# EAGLE design adc_lemon (EAGLE 6.0)
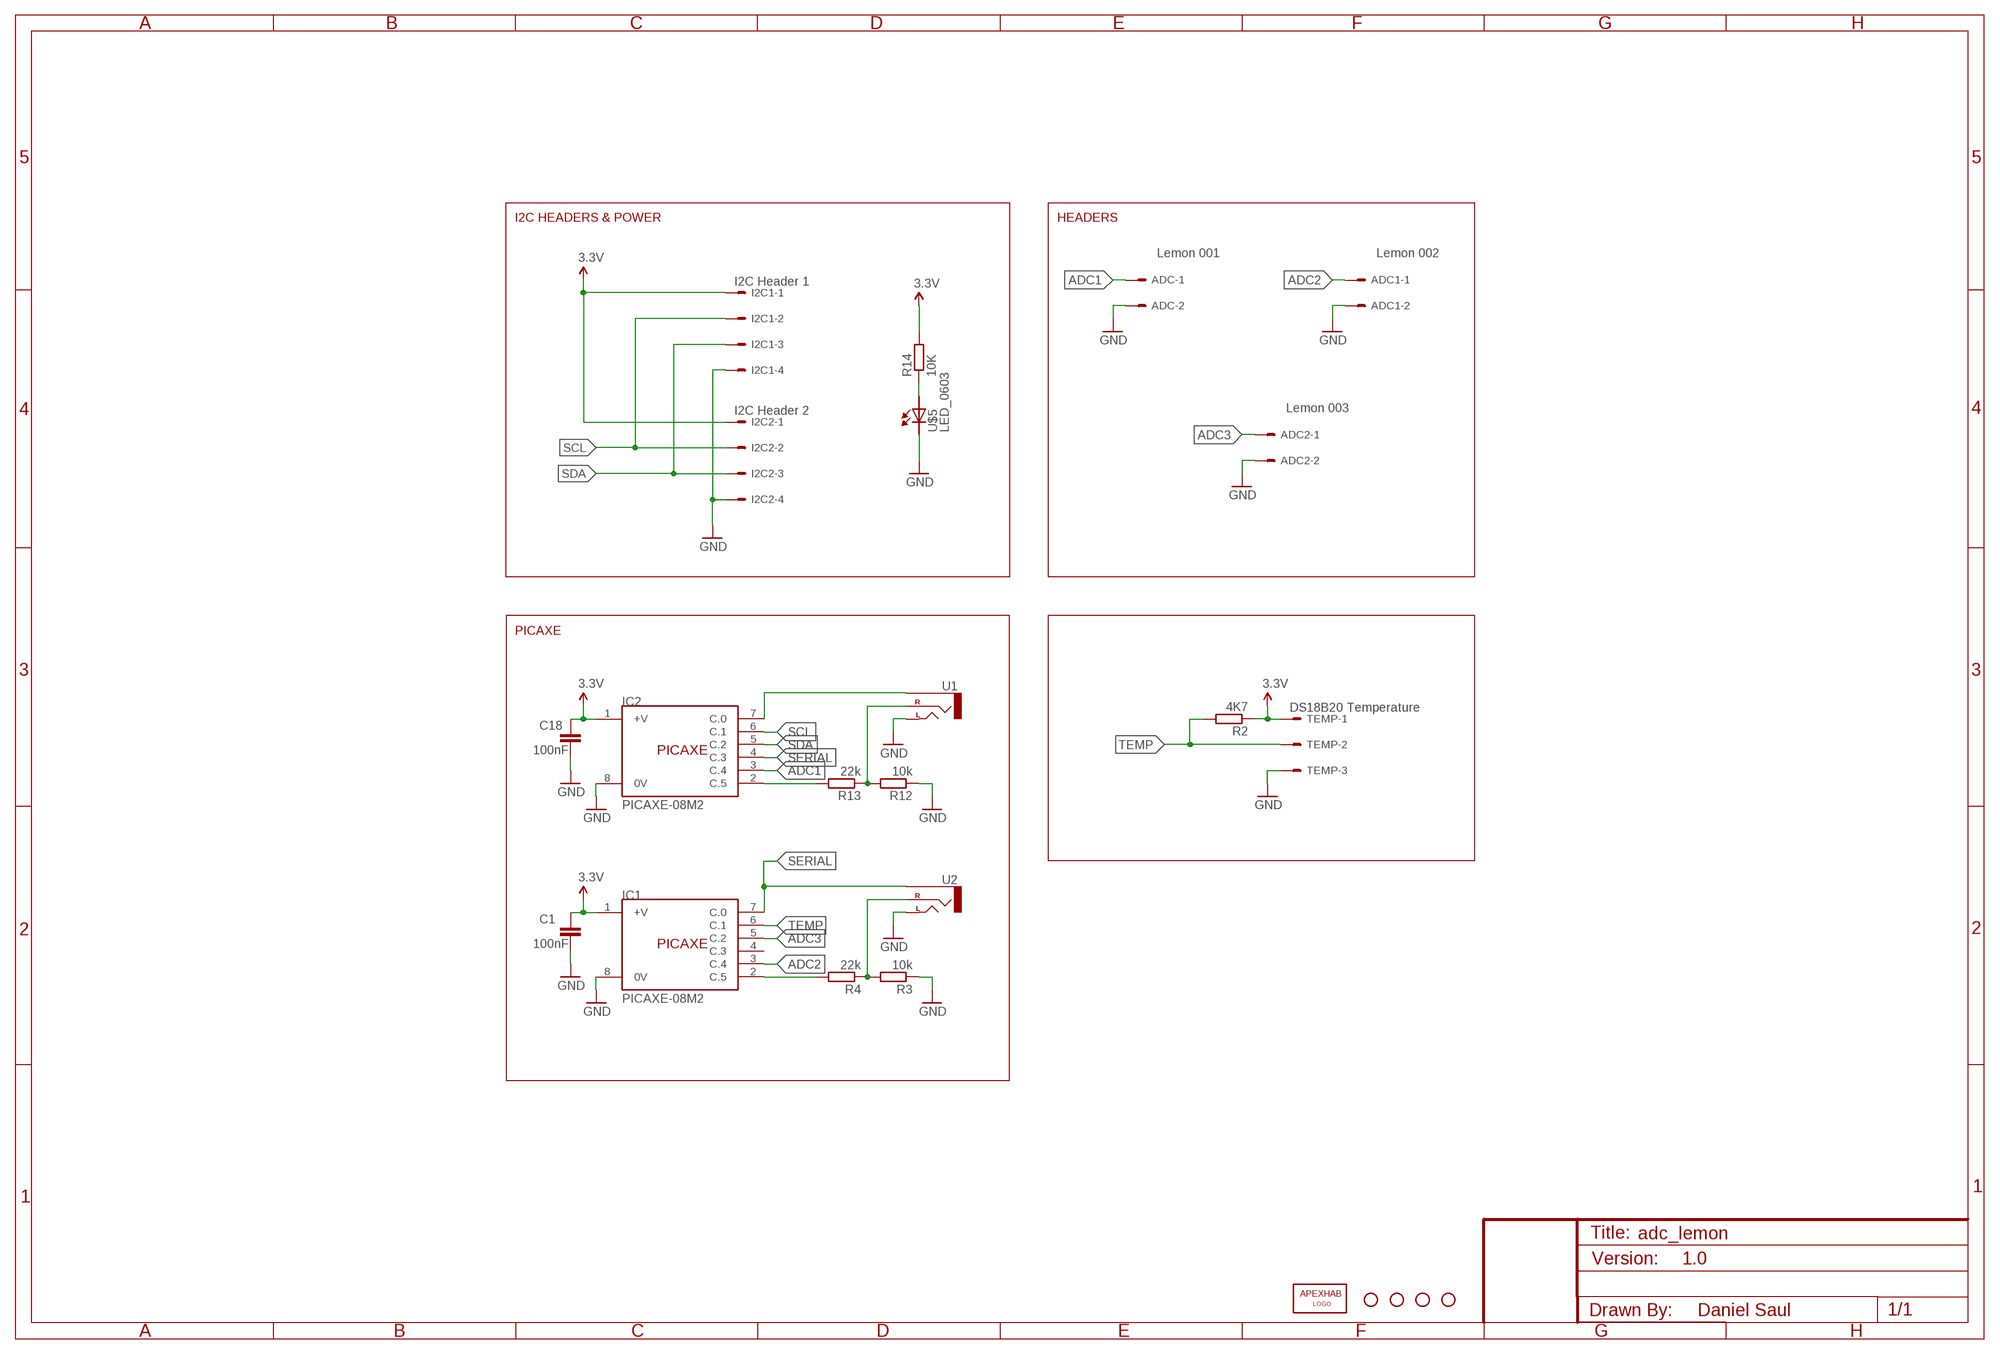
[diagram p0: schematic, sheet 1]

## Parts
ADC  Lemon 001  22-27-2021-02  [6410-02]
ADC1  Lemon 002  22-27-2021-02  [6410-02]
ADC2  Lemon 003  22-27-2021-02  [6410-02]
C1  100nF  C-EUC0805  [C0805]
C18  100nF  C-EUC0805  [C0805]
I2C1  I2C Header 1  22-27-2041-04  [6410-04]
I2C2  I2C Header 2  22-27-2041-04  [6410-04]
IC1  PICAXE-08M2  [SOIC8]
IC2  PICAXE-08M2  [SOIC8]
JP1  APEXHAB-LOGO_APEXHAB-SMALL  [APEXHAB-LOGO-SMALL]
JP2  STAND-OFF  [STAND-OFF]
JP3  STAND-OFF  [STAND-OFF]
JP4  STAND-OFF  [STAND-OFF]
JP5  STAND-OFF  [STAND-OFF]
R2  4K7  R-EU_R0805  [R0805]
R3  10k  R-EU_R0805  [R0805]
R4  22k  R-EU_R0805  [R0805]
R12  10k  R-EU_R0805  [R0805]
R13  22k  R-EU_R0805  [R0805]
R14  10K  R-EU_R0805  [R0805]
TEMP  DS18B20 Temperature  22-27-2031-03  [6410-03]
U1  AUDIO-JACKPTH  [AUDIO-JACK]
U2  AUDIO-JACKPTH  [AUDIO-JACK]
U$5  LED_0603  [CHIPLED_0603]

## Nets
3.3V: C1.1 C18.1 I2C1.1 I2C2.1 IC1.1(+V) IC2.1(+V) R2.1 R14.2 TEMP.1
ADC1: ADC.1 IC2.3(C.4)
ADC2: ADC1.1 IC1.3(C.4)
ADC3: ADC2.1 IC1.5(C.2)
GND: ADC1.2 ADC2.2 ADC.2 C1.2 C18.2 I2C1.4 I2C2.4 IC1.8(0V) IC2.8(0V) R3.1 R12.1 TEMP.3 U1.TIP(LEFT) U2.TIP(LEFT) U$5.C
N$4: IC1.2(C.5) R4.2
N$5: R3.2 R4.1 U2.RING(RIGHT)
N$17: IC2.2(C.5) R13.2
N$18: IC2.7(C.0) U1.SLEEVE
N$20: R12.2 R13.1 U1.RING(RIGHT)
N$21: R14.1 U$5.A
SCL: I2C1.2 I2C2.2 IC2.6(C.1)
SDA: I2C1.3 I2C2.3 IC2.5(C.2)
SERIAL: IC1.7(C.0) IC2.4(C.3) U2.SLEEVE
TEMP: IC1.6(C.1) R2.2 TEMP.2
Unconnected: IC1.4(C.3)

## Notes on the sheet
- I2C HEADERS & POWER | HEADERS
- PICAXE
- 1.0
- Daniel Saul

## Library data of the parts
ADC ADC1 ADC2 = apex:22-?-02: CONNECTOR wire to board 2.54 mm (.1 inch) pitch header; OC_FARNELL: unknown; OC_NEWARK: unknown
C1 C18 = rcl:C-EU: CAPACITOR, European symbol
I2C1 I2C2 = apex:22-?-04: CONNECTOR wire to board 2.54 mm (.1 inch) pitch header; OC_FARNELL: unknown; OC_NEWARK: unknown
IC1 IC2 = apex:PICAXE-08M2
JP1 = apex:APEXHAB-LOGO: ApexHAB PCB Logo This is the standard ApexHAB PCB logo.
JP2-JP5 = apex:STAND-OFF: Stand Off This is the mechanical footprint for a #4 phillips button head screw. Use the keepout ring to avoid running the screw head into surrounding components. SKU : PRT-00447
R2-R4 R12-R14 = rcl:R-EU_: RESISTOR, European symbol
TEMP = apex:22-?-03: CONNECTOR wire to board 2.54 mm (.1 inch) pitch header; OC_FARNELL: unknown; OC_NEWARK: unknown
U1 U2 = SparkFun:AUDIO-JACK: 3.5mm Audio Jack Simple 3.5mm common PCB mount audio jack. SKU: PRT-08032
U$5 = apex:LED: SMD LED

## Board
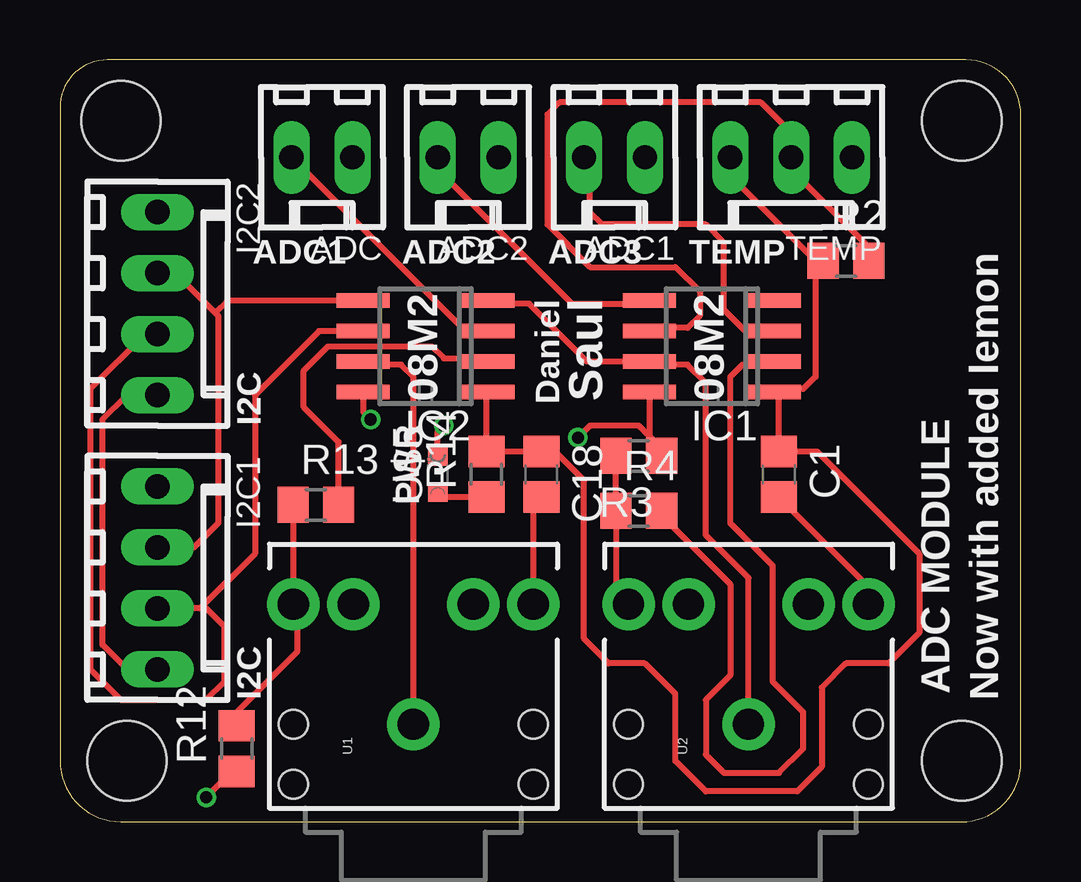
[diagram p1: board, top side]
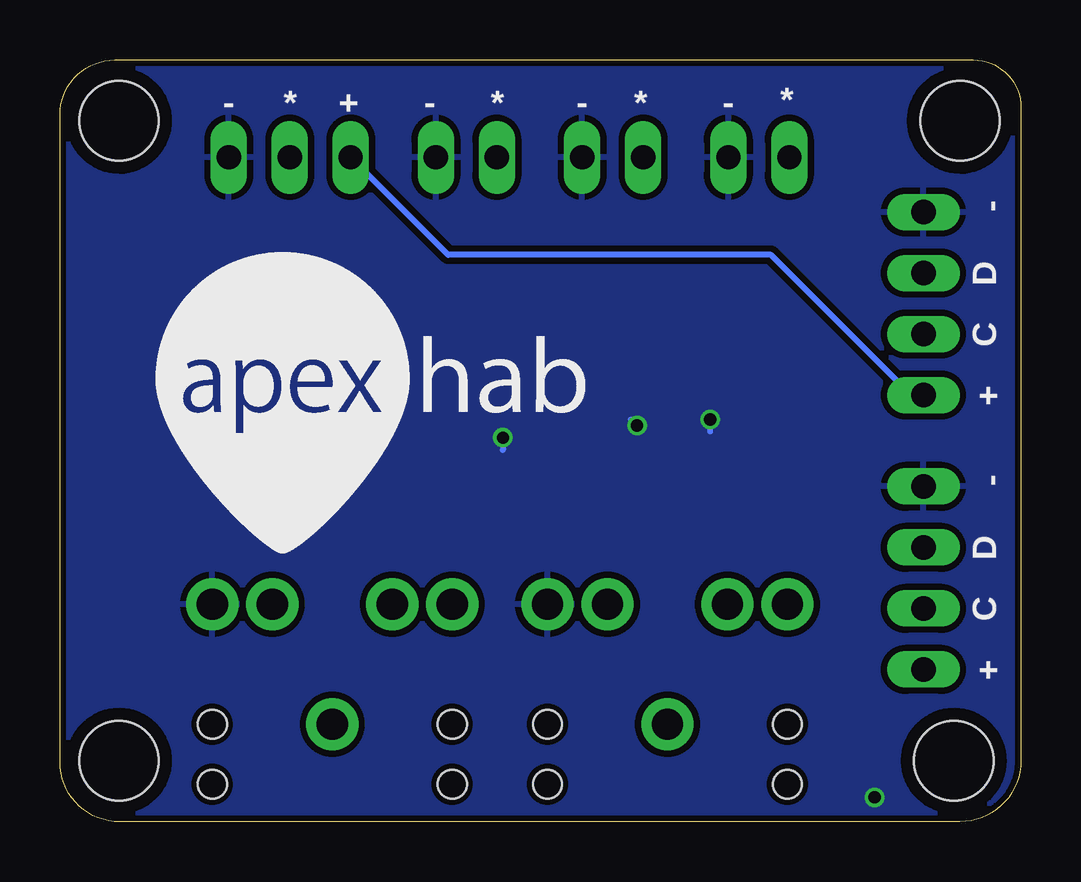
[diagram p2: board, bottom side, seen from below]

Size 40.06 x 31.74 mm. Coordinates in mm from the lower left corner, seen from the top.
Outline: 0,29.76 0,2.54 arc90 2.54,0 37.58,0 arc90 40.06,2.48 40.06,29.45 arc90 37.77,31.74 1.98,31.74 arc90 0,29.76
Copper layers (1*16): Top 0.035mm / dielectric 1.5mm / Bottom 0.035mm
Design rules: minimum track width 6mil, minimum drill 12mil, track to track 6mil, track to pad 6mil, pad to pad 6mil, via to via 6mil, smd to smd 0mil, copper to edge 10mil, drill to drill 10mil, minimum pad ring 10mil, minimum via ring 6mil, stop-mask expansion 2mil, vias tented up to drill 100mil, thermal gap 10mil

### Footprints (pad centres in the part's own frame; a part is rotated, then mirrored left to right if it is on the bottom)
6410-02 = drill 1.016 long: 1 1.27,0; 2 -1.27,0
C0805 = smd 1.3 x 1.5: 1 -0.95,0; 2 0.95,0
6410-04 = drill 1.016 long: 1 3.81,0; 2 1.27,0; 3 -1.27,0; 4 -3.81,0
SOIC8 = smd 0.6 x 2.2: 1 -1.905,-2.6; 2 -0.635,-2.6; 3 0.635,-2.6; 4 1.905,-2.6; 5 1.905,2.6; 6 0.635,2.6; 7 -0.635,2.6; 8 -1.905,2.6
STAND-OFF = hole 3.302: 0,0
R0805 = smd 1.3 x 1.5: 1 -0.95,0; 2 0.95,0
6410-03 = drill 1.016 long: 1 2.54,0; 2 0,0; 3 -2.54,0
AUDIO-JACK = drill 1.3 pad 2.184: RING 5,5; RSH 5,2.5; SLEEVE 0,0; TIP 5,-5; TSH 5,-2.5 | hole 1.2: 0,5; -2.5,5; -2.5,-5; 0,-5
CHIPLED_0603 = smd 0.8 x 0.8: A 0,-0.75; C 0,0.75

### Placement (x,y rotation side)
ADC  10.92,27.69 180 top
ADC1  23.11,27.69 180 top
ADC2  17.02,27.69 180 top
C1  29.97,14.48 270 top
C18  20.07,14.48 270 top
I2C1  4.06,10.16 270 top
I2C2  4.06,21.59 270 top
IC1  27.18,19.81 90 top
IC2  15.24,19.81 90 top
JP1  36.07,11.18 0 bottom
JP2  37.59,2.54 0 top
JP3  2.79,2.54 0 top
JP4  37.59,29.21 0 top
JP5  2.54,29.21 0 top
R2  32.77,23.37 0 top
R3  24.13,15.24 180 top
R4  24.13,12.95 0 top
R12  7.37,3.05 90 top
R13  10.67,13.21 0 top
R14  17.78,14.48 90 top
TEMP  30.48,27.69 180 top
U1  14.73,4.06 90 top
U2  28.7,4.06 90 top
U$5  15.75,14.48 0 top

### Tracks (layer width: path | path; a pad name or v marks a point on that pad's centre or on a via)
3.3V
  Top 0.254: I2C1.1 2.79,6.35 1.78,7.37 1.78,16.76 2.79,17.78 I2C2.1 | IC2.1 17.78,17.85 R14.2 C18.1 20.13,15.49 20.57,15.49 21.84,14.22 21.84,7.62 22.86,6.6 24.38,6.6 25.65,5.33 25.65,2.54 26.92,1.27 30.73,1.27 31.75,2.29 31.75,5.59 32.77,6.6 34.54,6.6 35.81,7.87 35.81,11.18 31.56,15.43 C1.1 29.97,17.71 IC1.1 29.91,18.03 30.99,18.03 31.5,18.54 31.5,23.37 | R2.1 31.5,23.37 | 31.5,23.37 27.94,26.92 TEMP.1
  Bottom 0.254: I2C2.1 4.57,17.78 10.41,23.62 23.88,23.62 TEMP.1
ADC1
  Top 0.254: ADC.1 16.76,20.57 17.71,20.57 IC2.3
ADC2
  Top 0.254: IC1.3 28.57,20.45 27.69,21.34 27.69,24.13 26.92,24.89 22.61,24.89 22.1,25.4 22.1,27.43 ADC1.1
ADC3
  Top 0.254: ADC2.1 15.75,27.18 21.34,21.59 24.45,21.59 IC1.5
GND  (via drill 0.51)
  Top 0.254: U2.TIP 33.7,9.8 C1.2 | U1.TIP 19.73,13.19 C18.2 | U$5.C 15.75,16.26 v16,16.51 | IC2.8 12.64,17.08 v12.95,16.76 | IC1.8 24.58,15.74 R3.1 25.08,15.56 24.13,16.51 22.1,16.51 v21.59,16 | R12.1 7.18,2.1 v6.1,1.02
  Bottom 0.254: v16,16.51 16.26,16.76 | v12.95,16.76 12.95,16.26 | v21.59,16 21.59,15.49 | v6.1,1.02 6.35,1.02
  pour Bottom (isolate 0.254): 0,0 40.13,0 40.13,31.75 0,31.75
N$4
  Top 0.254: R4.2 25.08,12.77 27.94,9.91 27.94,6.1 26.92,5.08 26.92,2.79 27.69,2.03 29.97,2.03 30.99,3.05 30.99,4.57 29.72,5.84 29.72,10.67 27.94,12.45 27.94,18.54 28.45,19.05 29.65,19.05 IC1.2
N$5
  Top 0.254: U2.RING 23.18,9.59 R4.1 R3.2
N$17
  Top 0.254: R13.2 11.62,15.81 10.16,17.27 10.16,18.8 11.18,19.81 15.49,19.81 16,19.3 17.71,19.3 IC2.2
N$18
  Top 0.254: U1.SLEEVE 14.73,18.54 14.22,19.05 12.77,19.05 IC2.7
N$20
  Top 0.254: R12.2 7.37,4.57 9.91,7.11 9.91,8.89 U1.RING 9.72,9.08 R13.1
N$21
  Top 0.254: R14.1 15.95,13.53 U$5.A
SCL
  Top 0.254: I2C2.2 3.56,20.32 1.27,18.03 1.27,6.35 2.54,5.08 6.1,5.08 6.86,5.84 6.86,8.13 6.1,8.89 5.84,8.89 | 5.84,8.89 I2C1.2 | IC2.6 10.79,20.45 8.13,17.78 8.13,11.18 5.84,8.89
SDA
  Top 0.254: I2C2.3 4.83,22.86 6.48,21.21 | 6.48,21.21 6.6,21.08 6.6,12.45 5.59,11.43 I2C1.3 | IC2.5 6.99,21.72 6.48,21.21
SERIAL
  Top 0.254: U2.SLEEVE 28.7,10.16 26.92,11.94 26.92,18.29 26.16,19.05 24.7,19.05 IC1.7 21.97,19.18 19.56,21.59 17.97,21.59 IC2.4
TEMP
  Top 0.254: R2.2 33.72,23.94 30.73,26.92 30.73,27.43 TEMP.2 30.48,28.7 29.21,29.97 20.83,29.97 20.32,29.46 20.32,24.89 22.1,23.11 25.65,23.11 26.67,22.1 26.67,21.08 26.16,20.57 24.7,20.57 IC1.6

### Text on the board
tPlace: ADC1 | ADC2 | ADC3 | TEMP | 08M2 | Saul | 08M2 | I2C | Daniel | PWR | I2C | ADC MODULE | Now with added lemon
bPlace: * | - | * | - | * | - | + | * | - | - | D | C | + | - | D | C | +